# EasyEDA Pro project ProPrj_42StepMotor_2025-09-30.epro, schematic motor

## Sheets
1 motor: Board Name: motor; Create Date: 2025-09-28; Page Name: motor; Project Name: 42StepMotor; Schematic Name: motor; Update Date: 2025-09-30; File: motor; Id: 1/1; Sheet: /
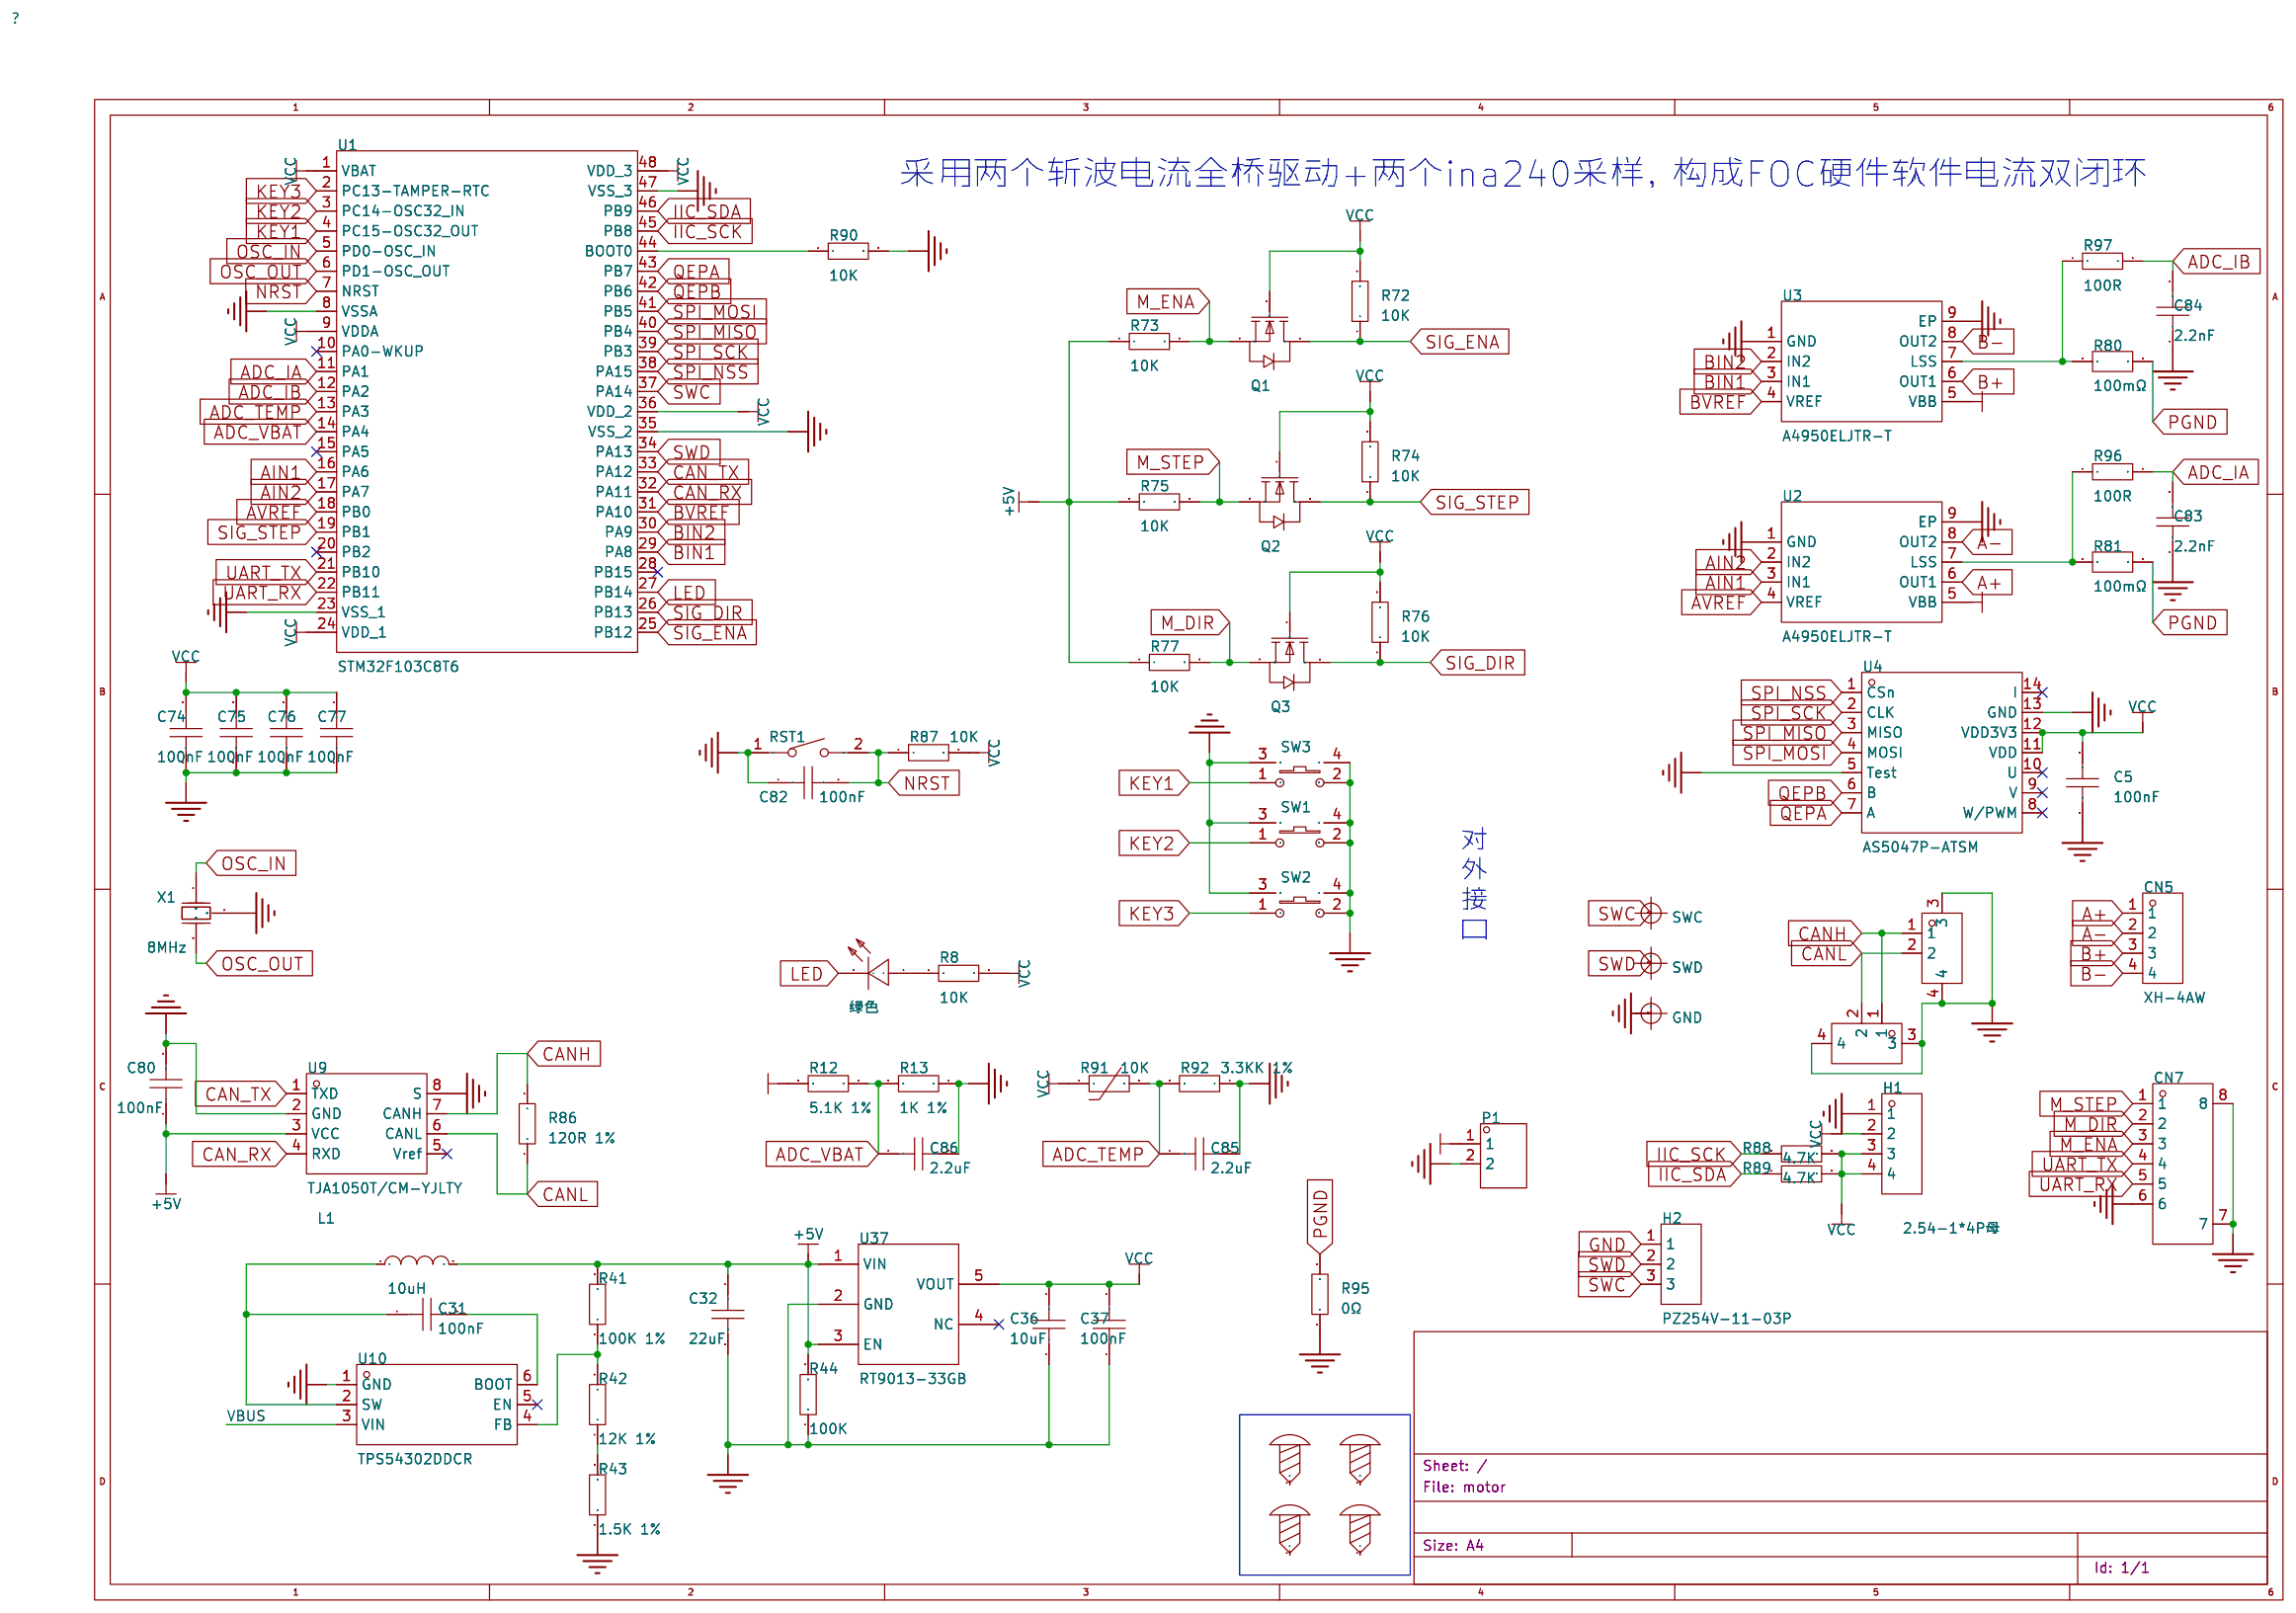
[diagram p0: motor]
2 Pin Select: Create Date: 2025-09-30; Page Name: Pin Select; Company: 嘉立创EDA; Page Size: A4; Version: V1.0
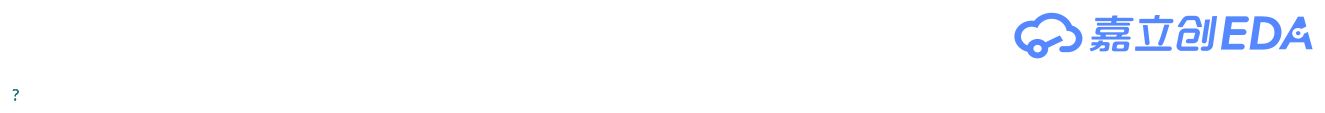
[diagram p1: Pin Select]

## Parts
C5  100nF  [C0603]
C31  100nF  [C0603]
C32  22uF  [C0805]
C36  10uF  [C0603]
C37  100nF  [C0603]
C74  100nF  [C0402]
C75  100nF  [C0402]
C76  100nF  [C0402]
C77  100nF  [C0402]
C80  100nF  [C0402]
C82  100nF  [C0402]
C83  2.2nF  [C0402]
C84  2.2nF  [C0402]
C85  2.2uF  [C0402]
C86  2.2uF  [C0402]
CN5  XH-4AW  [CONN-TH_XH-4AW]
CN6  HC-1.0-2PWT  [CONN-SMD_HC-1.0-2PWT]
CN7  HC-1.0-6PWT  [CONN-SMD_HCTL_HC-1.0-6PWT]
CN8  HC-1.0-2PWT  [CONN-SMD_HC-1.0-2PWT]
GND  GND  [Mark-Point-1mm]  (no BOM)
H1  2.54-1*4P母  [HDR-TH_4P-P2.54-V-F]
H2  PZ254V-11-03P  [HDR-TH_3P-P2.54-V-M]
L1  10uH  [IND-SMD_L3.0-W3.0_FTC303020D]
LED1  绿色  [LED0805-R-RD]
P1  WJ15EDGRC-3.81-2P  [CONN-TH_2P-P3.81_WJ15EDGRC-3.81-2P]
Q1  BSS138  [SOT-23-3_L2.9-W1.6-P1.90-LS2.8-BR]
Q2  BSS138  [SOT-23-3_L2.9-W1.6-P1.90-LS2.8-BR]
Q3  BSS138  [SOT-23-3_L2.9-W1.6-P1.90-LS2.8-BR]
R8  10K  [R0603]
R12  5.1K 1%  [R0603]
R13  1K 1%  [R0603]
R41  100K 1%  [R0603]
R42  12K 1%  [R0603]
R43  1.5K 1%  [R0603]
R44  100K  [R0603]
R72  10K  [R0603]
R73  10K  [R0603]
R74  10K  [R0603]
R75  10K  [R0603]
R76  10K  [R0603]
R77  10K  [R0603]
R80  100mΩ  [R1206]
R81  100mΩ  [R1206]
R86  120R 1%  [R0402]
R87  10K  [R0402]
R88  4.7K  [R0402]
R89  4.7K  [R0402]
R90  10K  [R0402]
R91  10K  [R0603]
R92  3.3KK 1%  [R0603]
R95  0Ω  [R0603]
R96  100R  [R0402]
R97  100R  [R0402]
RST1  轻触按键3*4*H  [SW-SMD_L4.0-W2.9-LS5.0]
SCREW1  -  [M3螺丝]
SCREW2  -  [M3螺丝]
SCREW3  -  [M3螺丝]
SCREW4  -  [M3螺丝]
SW1  TS24CA 250gf 013  [SW-SMD_L4.7-W3.5-P3.35-EH]
SW2  TS24CA 250gf 013  [SW-SMD_L4.7-W3.5-P3.35-EH]
SW3  TS24CA 250gf 013  [SW-SMD_L4.7-W3.5-P3.35-EH]
SWC  SWC  [Mark-Point-1mm]  (no BOM)
SWD  SWD  [Mark-Point-1mm]  (no BOM)
U1  STM32F103C8T6  [LQFP-48_L7.0-W7.0-P0.50-LS9.0-BL]
U2  A4950ELJTR-T  [SOIC-8_L4.9-W3.9-P1.27-LS6.0-BL-EP]
U3  A4950ELJTR-T  [SOIC-8_L4.9-W3.9-P1.27-LS6.0-BL-EP]
U4  AS5047P-ATSM  [TSSOP-14_L5.0-W4.4-P0.65-LS6.4-BL]
U9  TJA1050T/CM-YJLTY  [SOIC-8_L4.9-W3.9-P1.27-LS6.0-BL]
U10  TPS54302DDCR  [SOT-23-6_L2.9-W1.6-P0.95-LS2.8-BL]
U37  RT9013-33GB  [SOT-23-5_L3.0-W1.7-P0.95-LS2.8-BL]
X1  8MHz  [OSC-SMD_3P-L3.2-W1.3-P1.20-L]

## Library data of the parts
C5 C31 C36 C37 = CAP_0603: Supplier Footprint: 0603
C32 = CGA0805X5R226M350MT: 容值:22uF;精度:±20%;额定电压:35V;材质(温度系数):X5R;; LCSC Part Name: 22uF ±20% 35V; Supplier Part: C6119901; Manufacturer: HRE(芯声); Supplier Footprint: 0805; JLCPCB Part Class: 扩展库; Datasheet: https://atta.szlcsc.com/upload/public/pdf/source/20231129/D589D0CC4D260F7AC3A77E53B455CCB3.pdf; Supplier: LCSC; Tolerance: ±20%; Voltage Rated: 35V; Temperature Coefficient: X5R
C74-C77 C80 C82-C86 = CAP_0402: Supplier Footprint: 0402
CN5 = XH-4AW: 插针结构:1x4P;间距:2.54mm;安装方式:弯插;参考系列:XH;总PIN数:4P;排数:1;每排PIN数:4;行距:-;额定电流:3A;触头材质:黄铜;触头镀层:锡;工作温度:-25℃~+85℃;; LCSC Part Name: 1x4P 间距:2.54mm 弯插 系列:XH; Supplier Part: C2908613; Manufacturer: HCTL(华灿天禄); Supplier Footprint: 弯插,P=2.5mm; JLCPCB Part Class: 扩展库; Datasheet: https://item.szlcsc.com/datasheet/XH-4AW/3184384.html; Supplier: LCSC; Pins Structure: 1x4P; Pitch: 2.54mm; Mounting Type: 弯插; Reference Series: XH; Number of Pins: 4P; Number of Rows: 1; Number of PINs Per Row: 4; Current Rating: 3A; Contact Material: 黄铜; Contact Plating: 锡; Operating Temperature: -25℃~+85℃
CN6 CN8 = HC-1.0-2PWT: 插针结构:1x2P;间距:1mm;安装方式:卧贴;参考系列:SH;总PIN数:2P;排数:1;每排PIN数:2;行距:-;额定电流:1A;触头材质:磷青铜;触头镀层:锡;工作温度:-25℃~+85℃;; LCSC Part Name: 1x2P 间距:1mm 卧贴 系列:SH; Supplier Part: C2845361; Manufacturer: HCTL(华灿天禄); Supplier Footprint: SMD,P=1mm,卧贴; JLCPCB Part Class: 扩展库; Datasheet: https://item.szlcsc.com/datasheet/HC-1.0-2PWT/3039042.html; Supplier: LCSC; Pins Structure: 1x2P; Pitch: 1mm; Mounting Type: 卧贴; Reference Series: SH; Number of Pins: 2P; Number of Rows: 1; Number of PINs Per Row: 2; Current Rating: 1A; Contact Material: 磷青铜; Contact Plating: 锡; Operating Temperature: -25℃~+85℃; Voltage Rating: 50V; Plastic Material: LCP; Flame Retardant Rating: UL94V-0; Supplementary Features: 辅助焊脚; Z-Height of the Board: 3.2mm; X-Length of Bottom Edge on Board (Spacing Line): 4.3mm; Y-Width of Bottom Edge on Board: 5.05mm
CN7 = HC-1.0-6PWT: 插针结构:1x6P;间距:1mm;安装方式:卧贴;参考系列:SH;总PIN数:6P;排数:1;每排PIN数:6;行距:-;额定电流:1A;触头材质:磷青铜;触头镀层:锡;工作温度范围:-25℃~+85℃;; LCSC Part Name: 1x6P 间距:1mm 卧贴 系列:SH; Supplier Part: C2845365; Manufacturer: HCTL(华灿天禄); Supplier Footprint: SMD,P=1mm,卧贴; JLCPCB Part Class: 扩展库; Datasheet: https://atta.szlcsc.com/upload/public/pdf/source/20230707/696F47DD5B3D5495B4AB8BCE302E8A84.pdf; Supplier: LCSC; Pins Structure: 1x6P; Pitch: 1mm; Mounting Style: 卧贴; Reference Series: SH; Number of Pins: 6P; Number of Rows: 1; Number of PINs Per Row: 6; Current Rating (Max): 1A; Contact Material: 磷青铜; Contact Plating: 锡; Operating Temperature Range: -25℃~+85℃; Rated Voltage (Max): 50V; Plastic Material: LCP; Flame Retardant Rating: UL94V-0; Supplementary Features: 辅助焊脚; Z-Height of the Board: 3.2mm; X-Length of Bottom Edge on Board (Spacing Line): 8.3mm; Y-Width of Bottom Edge on Board: 5.05mm
GND SWC SWD = Mark-Point: Mark点
H1 = 2.54-1*4P母: 插孔结构:1x4P;间距:2.54mm;行距:-;圆孔/方孔:方孔;安装方式:直插;排数:单排;总孔位数:4P;额定电流:3A;额定电压:-;插孔方向:顶部;塑高:-;触头材质:青铜;触头镀层:-;工作温度:-40℃~+105℃;; LCSC Part Name: 间距:2.54mm 1x4P 直插; Supplier Part: C2718488; Manufacturer: BOOMELE(博穆精密); Supplier Footprint: 插件,P=2.54mm; JLCPCB Part Class: 扩展库; Datasheet: https://item.szlcsc.com/datasheet/2.54-1*4P%25E6%25AF%258D/2834502.html; Supplier: LCSC; Holes Structure: 1x4P; Pitch: 2.54mm; Circular Hole / Square Hole: 方孔; Mounting Type: 直插; Number of Rows: 单排; Number of Positions: 4P; Current Rating: 3A; Holes Direction: 顶部; Contact Material: 青铜; Operating Temperature: -40℃~+105℃
H2 = PZ254V-11-03P: 插针结构:1x3P;间距:2.54mm;行距:-;圆针/方针:方针;安装方式:直插;排数:单排;总PIN位数:3P;额定电流:3A;额定电压:250V;配合针长度:6mm;塑高:2.5mm;端接针长度:3mm;工作温度:-40℃~+105℃;颜色:黑色;; LCSC Part Name: 1x3P 间距:2.54mm 方针 直插; Supplier Part: C2937625; Manufacturer: XFCN(兴飞); Supplier Footprint: 插件,P=2.54mm; JLCPCB Part Class: 扩展库; Datasheet: https://item.szlcsc.com/datasheet/PZ254V-11-03P/3293280.html; Supplier: LCSC; Pin Structure: 1x3P; Pitch: 2.54mm; Circluar Pins/Square Pins: 方针; Mounting Type: 直插; Number of Rows: 单排; Number of Pins: 3P; Current Rating: 3A; Voltage Rating (Max): 250V; Length of Mating Pin: 6mm; Insulation Height: 2.5mm; Length of End Connection Pin: 3mm; Operating Temperature: -40℃~+105℃; Color: 黑色
L1 = XRTC303015D100MBCA: 电感值:10uH;精度:±20%;额定电流:2A;饱和电流(Isat):2.8A;类型:一体成型电感;; LCSC Part Name: 10uH ±20% 2.8A; Supplier Part: C39846822; Manufacturer: XR(祥如); Supplier Footprint: SMD,3x3mm; JLCPCB Part Class: 扩展库; Datasheet: https://atta.szlcsc.com/upload/public/pdf/source/20240812/E3CB86A892484F14CA80220D2A10CF35.pdf; Supplier: LCSC; Tolerance: ±20%; Current Rating: 2A; Current - Saturation(Isat): 2.8A; DC Resistance(DCR): 185mΩ; Type: 一体成型电感
LED1 = KT-0805Y: 发光颜色:黄色;功率:-;正向电流:-;主波长:-;二极管配置:-;透镜颜色:-;色温:-;发光角度:-;载带方式:-;工作温度:-;; LCSC Part Name: 0805 黄灯 高亮; Supplier Part: C2296; Manufacturer: KENTO; Supplier Footprint: 0805; JLCPCB Part Class: 基础库; Datasheet: https://atta.szlcsc.com/upload/public/pdf/source/20160421/1461205044170.pdf; Supplier: LCSC; Emitted Color: 黄色
P1 = WJ15EDGRC-3.81-2P: 连接器类型:板端/插座-闭口;固定方式:-;结构:1x2P;间距:3.81mm;颜色:-;安装方式:弯针;排数:1;每排PIN数:2;额定电流:-;额定电压:-;线规 - AWG:-;线规 - 平方毫米:-;工作温度:-40℃~+105℃;; LCSC Part Name: 1x2P 3.81mm 排数:1 每排P数:2; Supplier Part: C8387; Manufacturer: KANGNEX(康奈克斯电气); Supplier Footprint: 弯插,P=3.81mm; JLCPCB Part Class: 扩展库; Datasheet: https://item.szlcsc.com/datasheet/WJ15EDGRC-3.81-2P/8881.html; Supplier: LCSC; Connector Type: 板端/插座-闭口; Number of Positions or Pins: 1x2P; Pitch: 3.81mm; Mounting Type: 弯针; Number of Pins: 2P; Number of Rows: 1; Number of PINs Per Row: 2; Operating Temperature: -40℃~+105℃
Q1-Q3 = BSS138_C427380: 数量:1个N沟道;漏源电压(Vdss):50V;连续漏极电流(Id):340mA;导通电阻(RDS(on)):1.1Ω@10V；2Ω@4.5V;耗散功率(Pd):500mW;阈值电压(Vgs(th)):1.2V@250uA;; LCSC Part Name: 1个N沟道 耐压:50V 电流:340mA; Supplier Part: C427380; Manufacturer: MDD(辰达半导体); Supplier Footprint: SOT-23; JLCPCB Part Class: 扩展库; Datasheet: https://item.szlcsc.com/datasheet/BSS138/421498.html; Supplier: LCSC; Number: 1个N沟道; Drain to Source Voltage: 50V; Current - Continuous Drain(Id): 340mA; RDS(on): 1.1Ω@10V；2Ω@4.5V; Pd - Power Dissipation: 500mW; Gate Threshold Voltage (Vgs(th)): 1.2V@250uA; Gate Charge(Qg): 60nC@10V; Input Capacitance(Ciss): 23.8pF@30V; Reverse Transfer Capacitance (Crss@Vds): 1.5pF@30V; Operating Temperature: -55℃~+150℃
R8 R12 R13 R41-R44 R72-R77 R92 = Res_0603: Supplier Footprint: 0603
R80 R81 = RE1206F1R100: 电阻类型:采样电阻；合金电阻;阻值:100mΩ;精度:±1%;功率:1W;温度系数:±50ppm/℃;; LCSC Part Name: 100mΩ 1W 1206 ±1%; Supplier Part: C46961734; Manufacturer: JIERR(捷而瑞); Supplier Footprint: 1206; JLCPCB Part Class: 扩展库; Datasheet: https://item.szlcsc.com/datasheet/RE1206F1R100/49133273.html; Supplier: LCSC; Type: 采样电阻；合金电阻; Tolerance: ±1%; Power(Watts): 1W; Temperature Coefficient: ±50ppm/℃
R86-R90 R96 R97 = Res_0402: Supplier Footprint: 0402
R91 = HNTC0603-104F3950FB: Supplier Part: C49247668; Manufacturer: R+O(宏嘉诚); Supplier Footprint: 0603; JLCPCB Part Class: 扩展库; Datasheet: https://item.szlcsc.com/datasheet/HNTC0603-104F3950FB/51678321.html; Supplier: LCSC
R95 = 0603WAF0000T5E: 电阻类型:厚膜电阻;阻值:0Ω;精度:±1%;功率:100mW;工作电压:75V;温度系数:-;; LCSC Part Name: 0Ω ±1% 100mW 厚膜电阻; Supplier Part: C21189; Manufacturer: UNI-ROYAL(厚声); Supplier Footprint: 0603; JLCPCB Part Class: 基础库; Datasheet: https://item.szlcsc.com/datasheet/0603WAF0000T5E/21903.html; Supplier: LCSC; Type: 厚膜电阻; Tolerance: ±1%; Power(Watts): 100mW; Voltage-Supply(Max): 75V; Operating Temperature: -55℃~+155℃
RST1 = 轻触按键3*4*H: Supplier Part: C9900017573; Supplier Footprint: 轻触按键3*4*2.5; JLCPCB Part Class: 扩展库; Supplier: LCSC
SCREW1-SCREW4 = M3螺丝: Supplier Footprint: 插件
SW1-SW3 = TS24CA 250gf 013: 电路结构:单刀单掷;按钮形状:矩形按钮;作用力:2.5N;安装方式:卧贴;开关长度:-;开关宽度:-;开关高度:-;带支架:不带支架;触点电流:50mA;额定电压:12V;带灯:无;工作寿命:3万次;; LCSC Part Name: 2*4*3.5mm半包小贝贝TS-018小侧按键m165蓝牙耳机开关 250gf; Supplier Part: C5373430; Manufacturer: SHOU HAN(首韩); Supplier Footprint: SMD; JLCPCB Part Class: 扩展库; Datasheet: https://item.szlcsc.com/datasheet/TS24CA%2520250gf%2520013/6227347.html; Supplier: LCSC; Circuit: 单刀单掷; Actuator Style: 矩形按钮; Operating Force: 2.5N; Mounting Type: 卧贴; with Bracket: 不带支架; Contact Current: 50mA; Voltage Rating: 12V; Actuator/Cap Color: 黑色; With Lamp: 无; Life: 3万次; Operating Temperature: -40℃~+85℃
U1 = STM32F103C8T6: CPU内核:ARM-M3;CPU最大主频:72MHz;应用领域:-;; LCSC Part Name: 主流增强型ARM Cortex-M3 MCU，具有64 KB Flash、72 MHz CPU、电机控制、USB和CAN; Supplier Part: C8734; Manufacturer: ST(意法半导体); Supplier Footprint: LQFP-48(7x7); JLCPCB Part Class: 扩展库; Datasheet: https://item.szlcsc.com/datasheet/STM32F103C8T6/9243.html; Supplier: LCSC; CPU Core: ARM-M3; CPU Maximum Speed: 72MHz; Program Storage Size: 64KB; Program Memory Type: FLASH; Number of I/O: 37; ADC (Bit): 12bit; Voltage - Supply: 2V~3.6V
U2 U3 = A4950ELJTR-T: LCSC Part Name: 全桥DMOS PWM电机驱动器; Supplier Part: C82404; Manufacturer: ALLEGRO(美国埃戈罗); Supplier Footprint: SOIC-8-EP; JLCPCB Part Class: 扩展库; Datasheet: https://item.szlcsc.com/datasheet/A4950ELJTR-T/83561.html; Supplier: LCSC; RDS(on): 600mΩ; Peak Current: 6A; Operating Temperature: -40℃~+85℃
U4 = AS5047P-ATSM_C962063: Supplier Part: C962063; Manufacturer: ams(艾迈斯半导体); Supplier Footprint: TSSOP-14; JLCPCB Part Class: 扩展库; Datasheet: https://item.szlcsc.com/datasheet/AS5047P-ATSM/1043057.html; Supplier: LCSC
U9 = TJA1050T/CM-YJLTY: Supplier Part: C2911428; Supplier Footprint: SOIC-8; JLCPCB Part Class: 扩展库; Supplier: LCSC
U10 = TPS54302DDCR: 功能类型:降压型;输出类型:固定;输入电压:4.5V~28V;输出电压:5V;输出电流:3A;; LCSC Part Name: 4.5V至28V输入、3A输出、EMI友好的同步降压转换器; Supplier Part: C311983; Manufacturer: TI(德州仪器); Supplier Footprint: TSOT-23-6; JLCPCB Part Class: 扩展库; Datasheet: https://www.ti.com/cn/lit/gpn/tps54302; Supplier: LCSC; Function: 降压型; Output Type: 固定; Input Voltage: 4.5V~28V; Output Voltage: 5V; Output Current: 3A; Switching Frequency: 400kHz; Operating Temperature: -40℃~+125℃; Synchronous Rectification: 是; Number of Outputs: 1; Topology: 降压式; Quiescent Current (Iq): 45uA; Switch tube (built-in/external): 内置
U37 = RT9013-33GB: 输出类型:固定;最大输入电压:5.5V;输出电压:3.3V;输出电流:500mA;电源纹波抑制比(PSRR):50dB@(10kHz);输出极性:正极;; LCSC Part Name: 输入5.5V 输出3.3V 500mA; Supplier Part: C47773; Manufacturer: RICHTEK(立锜); Supplier Footprint: SOT-23-5; JLCPCB Part Class: 扩展库; Datasheet: https://atta.szlcsc.com/upload/public/pdf/source/20150504/1457707282459.pdf; Supplier: LCSC; Output Type: 固定; Maximum Input Voltage: 5.5V; Output Voltage: 3.3V; Output Current: 500mA; Power Supply Rejection Ratio (PSRR): 50dB@(10kHz); Dropout Voltage: 400mV@(500mA); standby current: 50uA; Feature: 低ESR；防静电保护；热保护(TSD)；过流保护(OCP)；带使能; Operating Temperature: -40℃~+85℃; Output Polarity: 正极; Number of Outputs: 1
X1 = CSTNE8M00G550000R0: 频率:8MHz;内置负载电容:33pF;谐振阻抗:40Ω;; LCSC Part Name: 8MHz ±0.5% 内置负载电容:33pF; Supplier Part: C341522; Manufacturer: muRata(村田); Supplier Footprint: SMD3213-3P; JLCPCB Part Class: 扩展库; Datasheet: https://item.szlcsc.com/datasheet/CSTNE8M00G550000R0/318914.html; Supplier: LCSC; Built - in Load Capacitance: 33pF; Resonant Impedance: 40Ω; Operating Temperature: -40℃~+85℃

## Nets
+5V: C32.1 C80.1 L1.2 R41.2 R44.2 R73.1 R75.1 R77.1 U9.3(VCC) U37.1(VIN) U37.3(EN)
GND: C5.1 C32.2 C36.1 C37.1 C74.1 C75.1 C76.1 C77.1 C80.2 C82.1 C83.1 C84.1 C85.2 C86.2 CN6.3 CN6.4 CN7.6 CN7.7 CN7.8 CN8.3 CN8.4 GND.1 H1.1 H2.1 P1.2 R13.1 R43.1 R44.1 R90.2 R92.1 R95.1 RST1.1 SW1.2 SW1.3 SW1.4 SW2.2 SW2.3 SW2.4 SW3.2 SW3.3 SW3.4 U1.8(VSSA) U1.23(VSS_1) U1.35(VSS_2) U1.47(VSS_3) U2.1(GND) U2.9(EP) U3.1(GND) U3.9(EP) U4.5(Test) U4.13(GND) U9.2(GND) U9.8(S) U10.1(GND) U37.2(GND) X1.2(GND)
PGND: R80.2 R81.2 R95.2
VBUS: P1.1 R12.2 U2.5(VBB) U3.5(VBB) U10.3(VIN)
VCC: C5.2 C36.2 C37.2 C74.2 C75.2 C76.2 C77.2 H1.2 H1.3 H1.4 Q1.1(G) Q2.1(G) Q3.1(G) R8.2 R72.2 R74.2 R76.2 R87.2 R88.2 R89.2 R91.1 U1.1(VBAT) U1.9(VDDA) U1.24(VDD_1) U1.36(VDD_2) U1.48(VDD_3) U4.11(VDD) U4.12(VDD3V3) U37.5(VOUT)
A+: CN5.1 U2.6(OUT1)
A-: CN5.2 U2.8(OUT2)
ADC_IA: C83.2 R96.2 U1.11(PA1)
ADC_IB: C84.2 R97.2 U1.12(PA2)
ADC_TEMP: C85.1 R91.2 R92.2 U1.13(PA3)
ADC_VBAT: C86.1 R12.1 R13.2 U1.14(PA4)
AIN1: U1.16(PA6) U2.3(IN1)
AIN2: U1.17(PA7) U2.2(IN2)
AVREF: U1.18(PB0) U2.4(VREF)
B+: CN5.3 U3.6(OUT1)
B-: CN5.4 U3.8(OUT2)
BIN1: U1.29(PA8) U3.3(IN1)
BIN2: U1.30(PA9) U3.2(IN2)
BVREF: U1.31(PA10) U3.4(VREF)
CAN_RX: U1.32(PA11) U9.4(RXD)
CAN_TX: U1.33(PA12) U9.1(TXD)
CANH: CN6.1 CN8.1 R86.2 U9.7(CANH)
CANL: CN6.2 CN8.2 R86.1 U9.6(CANL)
IIC_SCK: R88.1 U1.45(PB8)
IIC_SDA: R89.1 U1.46(PB9)
KEY1: SW3.1 U1.4(PC15-OSC32_OUT)
KEY2: SW1.1 U1.3(PC14-OSC32_IN)
KEY3: SW2.1 U1.2(PC13-TAMPER-RTC)
LED: LED1.2(-) U1.27(PB14)
M_DIR: CN7.2 Q3.2(S) R77.2
M_ENA: CN7.3 Q1.2(S) R73.2
M_STEP: CN7.1 Q2.2(S) R75.2
NRST: C82.2 R87.1 RST1.2 U1.7(NRST)
OSC_IN: U1.5(PD0-OSC_IN) X1.1(OSC1)
OSC_OUT: U1.6(PD1-OSC_OUT) X1.3(OSC2)
QEPA: U1.43(PB7) U4.7(A)
QEPB: U1.42(PB6) U4.6(B)
SIG_DIR: Q3.3(D) R76.1 U1.26(PB13)
SIG_ENA: Q1.3(D) R72.1 U1.25(PB12)
SIG_STEP: Q2.3(D) R74.1 U1.19(PB1)
SPI_MISO: U1.40(PB4) U4.3(MISO)
SPI_MOSI: U1.41(PB5) U4.4(MOSI)
SPI_NSS: U1.38(PA15) U4.1(CSn)
SPI_SCK: U1.39(PB3) U4.2(CLK)
SWC: H2.3 SWC.1 U1.37(PA14)
SWD: H2.2 SWD.1 U1.34(PA13)
UART_RX: CN7.5 U1.22(PB11)
UART_TX: CN7.4 U1.21(PB10)
$1N3875: R90.1 U1.44(BOOT0)
$1N4481: R80.1 R97.1 U3.7(LSS)
$1N4611: R81.1 R96.1 U2.7(LSS)
$1N11056: LED1.1(+) R8.1
$1N14059: C31.1 L1.1 U10.2(SW)
$1N14063: C31.2 U10.6(BOOT)
$1N14064: R42.1 R43.2
$1N14066: R41.1 R42.2 U10.4(FB)

Not connected (* = marked no-connect by the designer): SCREW1 1; SCREW2 1; SCREW3 1; SCREW4 1; U1 10(PA0-WKUP)* 15(PA5)* 20(PB2)* 28(PB15)*; U4 8(W/PWM)* 9(V)* 10(U)* 14(I)*; U9 5(Vref)*; U10 5(EN)*; U37 4(NC)*

## Notes on the sheets
sheet 1
- 采用两个斩波电流全桥驱动+两个ina240采样，构成FOC硬件软件电流双闭环
- 对
  外
  接
  口
